# Altium schematic sheet git_test.SchDoc
size A; SheetNumber: 1; SheetTotal: 1
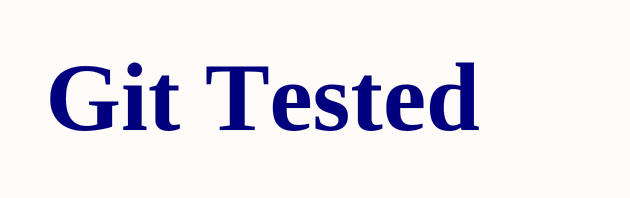
[diagram p0: git_test.SchDoc]

## Notes on the sheet
- Git Tested